# EAGLE design RepeterMySensorsXIAO (EAGLE 9.6.2)
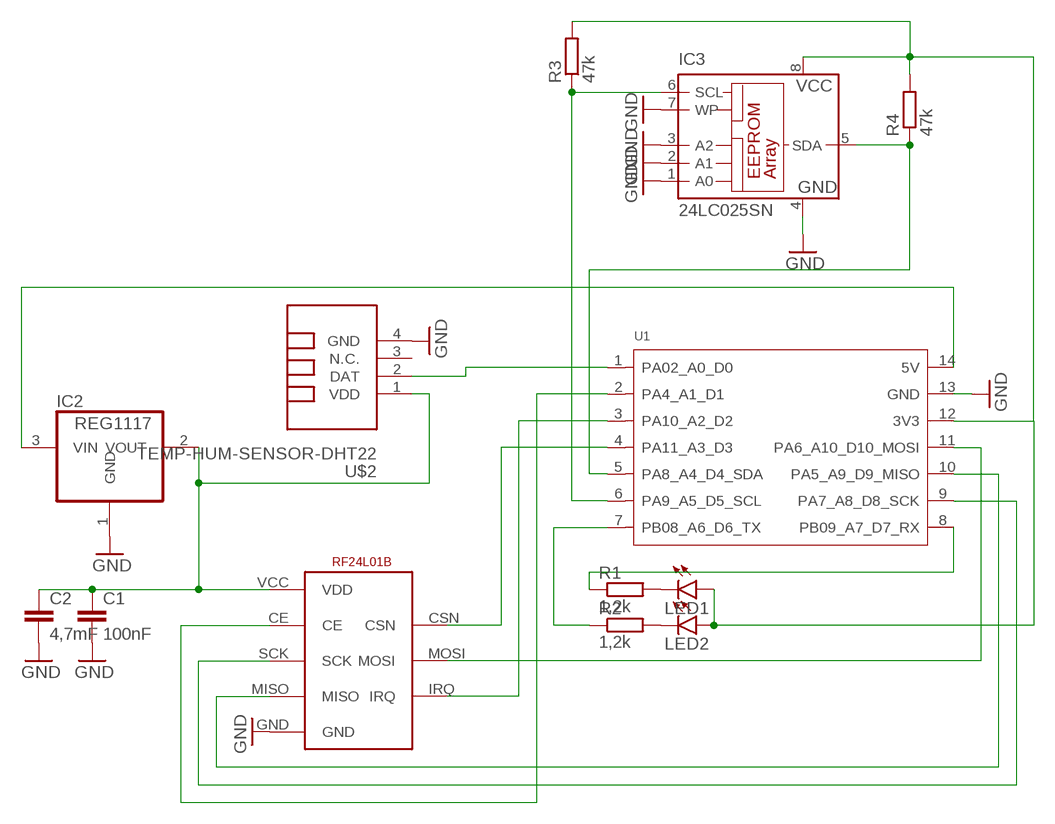
[diagram p0: schematic, sheet 1]

## Parts
C1  100nF  C-EUC1206  [C1206]
C2  4,7mF  C-EUC1210  [C1210]
IC2  REG1117  [SOT223]
IC3  24LC025SN  [SO-08]
LED1  LEDB152  [Q62902-B152]
LED2  LEDB152  [Q62902-B152]
R1  1,2k  R-EU_M1206  [M1206]
R2  1,2k  R-EU_M1206  [M1206]
R3  47k  R-EU_M1206  [M1206]
R4  47k  R-EU_M1206  [M1206]
U1  MOUDLE-SEEEDUINO-XIAO  [MOUDLE14P-2.54-21X17.8MM]
U$2  TEMP-HUM-SENSOR-DHT22  [TEMP-HUM-SENSOR-DHT22]
U$3  NRF24L01EBYTE  [24L01EBYTE]

## Nets
GND: C1.2 C2.2 IC2.1(GND) IC3.1(A0) IC3.2(A1) IC3.3(A2) IC3.4(GND) IC3.7(WP) U1.13(GND) U$2.4(GND) U$3.GND
N$1: C1.1 C2.1 IC2.2(VOUT) U$2.1(VDD) U$3.VCC(VDD)
N$2: U1.11(PA6_A10_D10_MOSI) U$3.MOSI
N$3: IC3.8(VCC) LED1.A LED2.A R3.2 R4.2 U1.12(3V3)
N$4: IC2.3(VIN) U1.14(5V)
N$5: LED1.K(C) R1.2
N$6: U1.3(PA10_A2_D2) U$3.IRQ
N$7: U1.4(PA11_A3_D3) U$3.CSN
N$8: U1.1(PA02_A0_D0) U$2.2(DAT)
N$9: U1.10(PA5_A9_D9_MISO) U$3.MISO
N$10: U1.9(PA7_A8_D8_SCK) U$3.SCK
N$11: LED2.K(C) R2.2
N$12: U1.2(PA4_A1_D1) U$3.CE
N$13: R2.1 U1.7(PB08_A6_D6_TX)
N$14: IC3.5(SDA) R4.1 U1.5(PA8_A4_D4_SDA)
N$15: IC3.6(SCL) R3.1 U1.6(PA9_A5_D5_SCL)
N$16: R1.1 U1.8(PB09_A7_D7_RX)
Unconnected: U$2.3(N.C.)

## Library data of the parts
C1 C2 = rcl:C-EU: CAPACITOR, European symbol; SPICEPREFIX: C
IC2 = burr-brown:REG1117: 800mA and 1A Low Dropout (LDO) Positive Regulator 1.8V, 2.5V, 2.85V, 3.3V, 5V, and Adj; MPN: REG1117; OC_FARNELL: 1097566; OC_NEWARK: 14P6981
IC3 = microchip:24*: Serial EEPROM I2C; MF: MICROCHIP; MPN: 24LC025/SN; OC_FARNELL: unknown; OC_NEWARK: 92C7103
LED1 LED2 = led:LED: LED OSRAM: - CHIPLED LG R971, LG N971, LY N971, LG Q971, LY Q971, LO R971, LY R971 LH N974, LH R974 LS Q976, LO Q976, LY Q976 LO Q996 - Hyper CHIPLED LW Q18S LB Q993, LB Q99A, LB R99A - SideLED LS A670, LO A670, LY A670, LG A670, LP A670 LB A673, LV A673, LT A673, LW A673 LH A674 LY A675 LS A676, LA A676, LO A676, LY A676, LW A676 LS A679, LY A679, LG A679 - Hyper Micro SIDELED® LS Y876, LA Y876, LO Y876, LY Y876 LT Y87S - SmartLED LW L88C, LW L88S LB L89C, LB L89S, LG L890 LS L89K, LO L89K, LY L89K LS L896, LA L896, LO L896, LY L896 - TOPLED LS T670, LO T670, LY T670, LG T670, LP T670 LSG T670, LSP T670, LSY T670, LOP T670, LYG T670 LG T671, LOG T671, LSG T671 LB T673, LV T673, LT T673, LW T673 LH T674 LS T676, LA T676, LO T676, LY T676, LB T676, LH T676, LSB T676, LW T676 LB T67C, LV T67C, LT T67C, LS T67K, LO T67K, LY T67K, LW E67C LS E67B, LA E67B, LO E67B, LY E67B, LB E67C, LV E67C, LT E67C LW T67C LS T679, LY T679, LG T679 LS T770, LO T770, LY T770, LG T770, LP T770 LB T773, LV T773, LT T773, LW T773 LH T774 LS E675, LA E675, LY E675, LS T675 LS T776, LA T776, LO T776, LY T776, LB T776 LHGB T686 LT T68C, LB T68C - Hyper Mini TOPLED® LB M676 - Mini TOPLED Santana® LG M470 LS M47K, LO M47K, LY M47K Source: http://www.osram.convergy.de LUXEON: - LUMILED® LXK2-PW12-R00, LXK2-PW12-S00, LXK2-PW14-U00, LXK2-PW14-V00 LXK2-PM12-R00, LXK2-PM12-S00, LXK2-PM14-U00 LXK2-PE12-Q00, LXK2-PE12-R00, LXK2-PE12-S00, LXK2-PE14-T00, LXK2-PE14-U00 LXK2-PB12-K00, LXK2-PB12-L00, LXK2-PB12-M00, LXK2-PB14-N00, LXK2-PB14-P00, LXK2-PB14-Q00 LXK2-PR12-L00, LXK2-PR12-M00, LXK2-PR14-Q00, LXK2-PR14-R00 LXK2-PD12-Q00, LXK2-PD12-R00, LXK2-PD12-S00 LXK2-PH12-R00, LXK2-PH12-S00 LXK2-PL12-P00, LXK2-PL12-Q00, LXK2-PL12-R00 Source: www.luxeon.com KINGBRIGHT: KA-3528ASYC Source: www.kingbright.com
R1-R4 = rcl:R-EU_: RESISTOR, European symbol; SPICEPREFIX: R
U1 = Seeeduino XIAO:MOUDLE-SEEEDUINO-XIAO
U$2 = diy-modules:TEMP-HUM-SENSOR-DHT22: DHT22 - digital humidity & temperature sensor Also known as: AM2302 AM2302 datasheet available here: http://akizukidenshi.com/download/ds/aosong/AM2302.pdf Click here to find device on ebay.com <http://www.ebay.com/sch/dht22+digital+sensor>
U$3 = nrf24l01:NRF24L01EBYTE

## Board
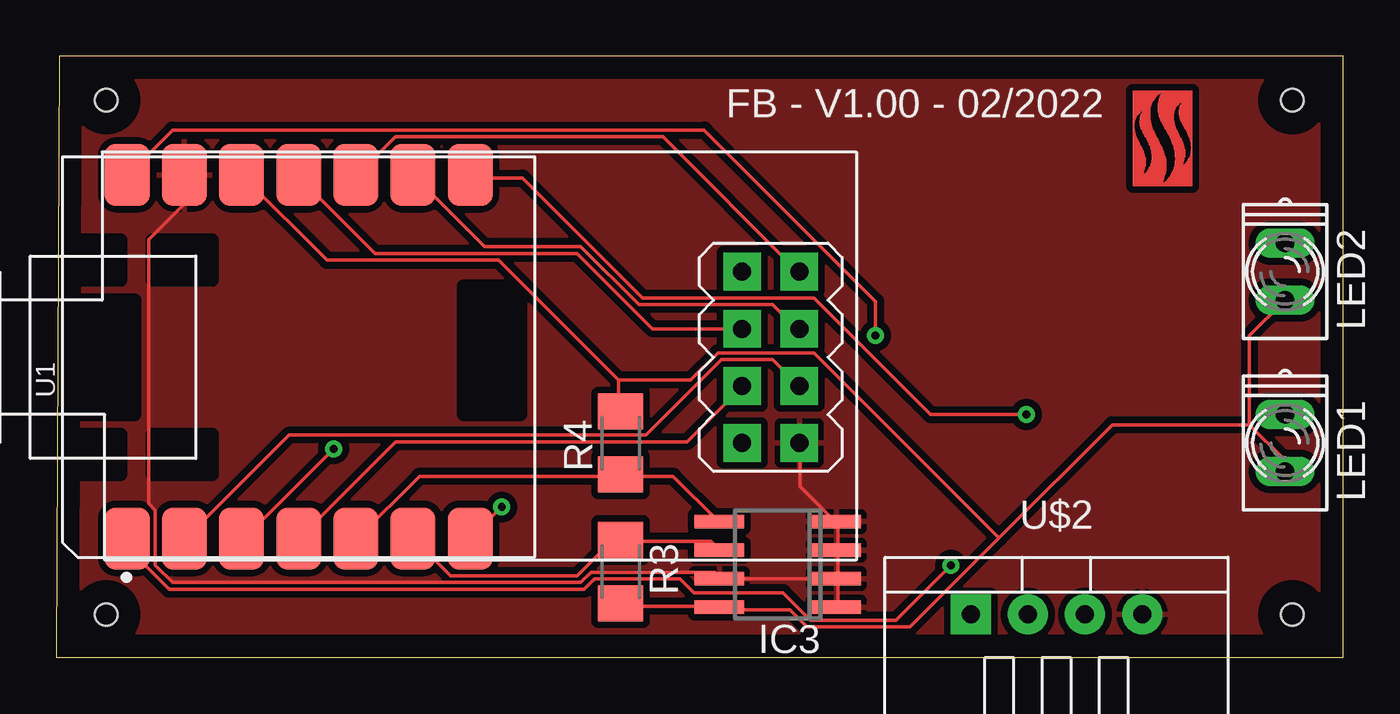
[diagram p1: board, top side]
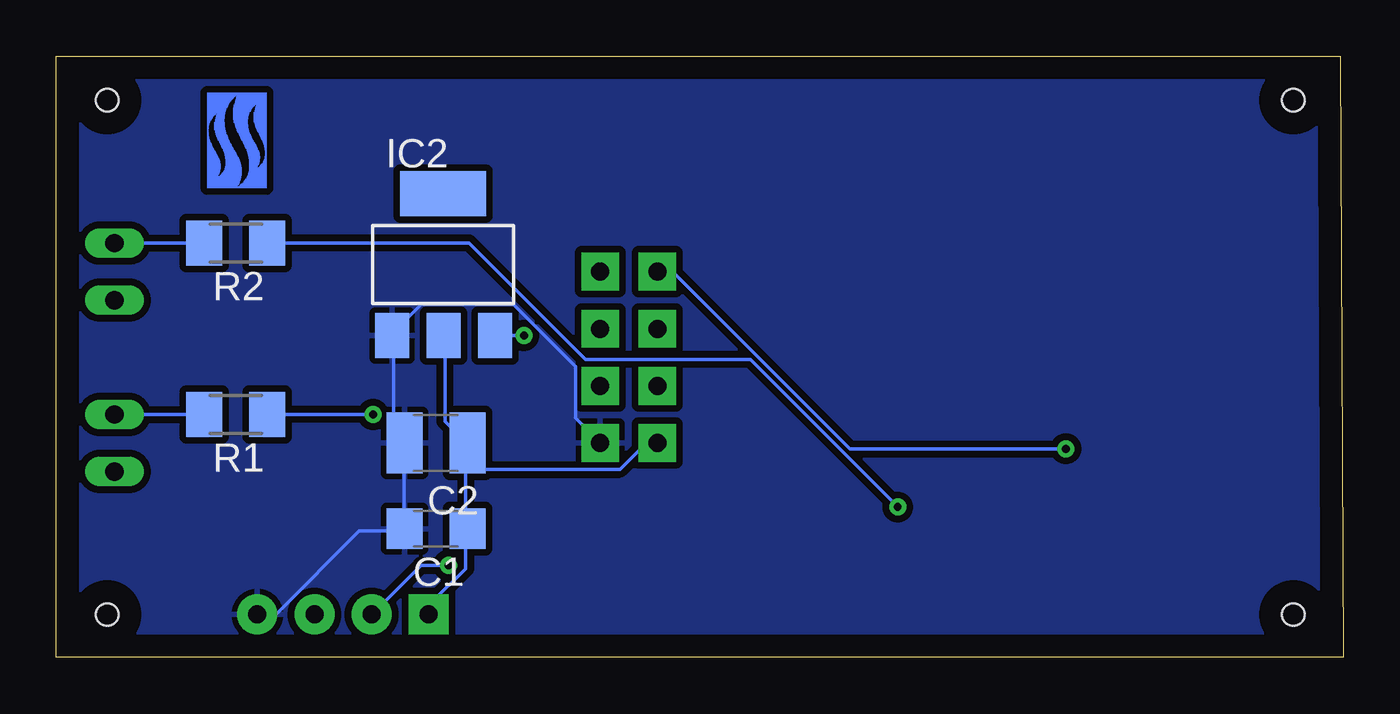
[diagram p2: board, bottom side, seen from below]

Size 57.19 x 26.72 mm. Coordinates in mm from the lower left corner, seen from the top.
Outline: 0,0 57.19,0 57.19,26.72 0.13,26.72 0,0
Copper layers (1*16): Top 0.035mm / dielectric 1.5mm / Bottom 0.035mm
Design rules "default": minimum track width 6mil, minimum drill 0.35mm, track to track 6mil, track to pad 6mil, pad to pad 6mil, via to via 6mil, smd to smd 6mil, copper to edge 40mil, drill to drill 6mil, minimum pad ring 10mil, minimum via ring 8mil, stop-mask expansion 4mil, vias tented up to drill 0mil, thermal gap 10mil
Holes 1 mm at 2.22,24.77 2.22,1.9 54.93,1.9 54.93,24.77

### Footprints (pad centres in the part's own frame; a part is rotated, then mirrored left to right if it is on the bottom)
C1206 = smd 1.6 x 1.8: 1 -1.4,0; 2 1.4,0
C1210 = smd 1.6 x 2.7: 1 -1.4,0; 2 1.4,0
SOT223 = smd 1.499 x 2.007: 1 -2.261,-3.15; 2 0.025,-3.15; 3 2.311,-3.15 | smd 3.81 x 2.007: 4 0,3.15
SO-08 = smd 0.6 x 2.2: 1 -1.905,-2.6; 2 -0.635,-2.6; 3 0.635,-2.6; 4 1.905,-2.6; 5 1.905,2.6; 6 0.635,2.6; 7 -0.635,2.6; 8 -1.905,2.6
Q62902-B152 = drill 0.813 long: A 1.27,0; K -1.27,0
M1206 = smd 1.6 x 2: 1 -1.4,0; 2 1.4,0
MOUDLE14P-2.54-21X17.8MM = smd 2.75 x 2: 1 0.835,18.12; 2 0.835,15.58; 3 0.835,13.04; 4 0.835,10.5; 5 0.835,7.96; 6 0.835,5.42; 7 0.835,2.88; 8 17,2.88; 9 17,5.42; 10 17,7.96; 11 17,10.5; 12 17,13.04; 13 17,15.58; 14 17,18.12
TEMP-HUM-SENSOR-DHT22 = drill 0.8 pad 1.778 square: 1 -3.81,0 | drill 0.8 pad 1.778: 2 -1.27,0; 3 1.27,0; 4 3.81,0
24L01EBYTE = drill 0.8 pad 1.676 square: CE -17.78,1.27; CSN -15.24,1.27; GND -17.78,3.81; IRQ -15.24,-3.81; MISO -17.78,-3.81; MOSI -15.24,-1.27; SCK -17.78,-1.27; VCC -15.24,3.81

### Placement (x,y rotation side)
C1  40.32,5.71 180 bottom
C2  40.32,9.53 180 bottom
IC2  40,17.46 0 bottom
IC3  32.07,4.13 90 top
LED1  54.61,9.53 270 top
LED2  54.61,17.14 270 top
R1  49.21,10.79 180 bottom
R2  49.21,18.41 180 bottom
R3  25.08,3.81 270 top
R4  25.08,9.53 90 top
U1  21.27,4.45 90 top
U$1  [FB]  50.48,20.95 0 bottom
U$2  44.45,1.9 0 top
U$3  15.24,13.34 180 top
U$4  [FB]  50.48,25.08 180 top

### Tracks (layer width: path | path; a pad name or v marks a point on that pad's centre or on a via)
GND
  Top 0.152: IC3.2 34.58,3.48 29.55,3.48 IC3.7 29.4,3.63 29.25,3.79 23.76,3.79 23.3,3.33 5.17,3.33 4.41,4.09 4.41,6.53 4.1,6.83 4.1,18.57 5.63,20.09 5.63,21.31 U1.13 | IC3.1 34.73,2.26 34.73,3.48 IC3.2 | IC3.2 34.73,3.63 34.73,4.7 IC3.3 34.73,4.85 34.73,5.92 IC3.4 34.58,6.07 33.06,7.59 33.06,9.42 U$3.GND
  Bottom 0.152: U$2.4 48.15,1.96 47.38,1.96 43.73,5.61 41.74,5.61 C1.2 41.74,5.77 41.74,9.42 C2.2 41.74,9.58 42.2,10.03 42.2,14.3 IC2.1 42.2,14.45 40.98,15.67 36.87,15.67 34.12,12.93 34.12,10.64 33.06,9.58 U$3.GND
  pour Top (isolate 0.305): -0.32,27.3 56.83,27.3 56.83,-0.64 -0.32,-0.64
  pour Bottom (isolate 0.305): -0.32,27.3 56.83,27.3 56.83,-0.64 -0.32,-0.64
N$1
  Bottom 0.152: 39,8.36 39,9.42 C2.1 | 39,8.36 39,5.77 C1.1 39,5.61 39,3.94 40.53,2.41 40.53,1.96 U$2.1 | IC2.2 39.92,14.3 39.92,10.49 39,9.58 C2.1 | 39,8.36 32.14,8.36 31.08,9.42 30.62,9.42 U$3.VCC | 39,8.36 C2.1
N$2
  Top 0.152: U$3.MOSI 26.5,14.61 23.15,17.96 14.16,17.96 10.81,21.31 U1.11
N$3
  Top 0.152: 24.98,12.32 24.98,10.95 R4.2 | 24.98,12.32 19.65,17.65 12.03,17.65 8.37,21.31 U1.12 | R3.2 25.13,2.26 29.4,2.26 IC3.8 29.55,2.11 32.6,2.11 33.36,1.35 37.93,1.35 41.9,5.31 | 53.02,10.34 54.55,8.81 54.55,8.36 LED1.A | 53.02,10.34 53.02,14.3 54.55,15.82 LED2.A | 41.9,5.31 46.93,10.34 53.02,10.34 | 24.98,12.32 28.18,12.32 29.4,13.54 33.67,13.54 41.9,5.31
N$4  (via drill 0.35)
  Top 0.152: v36.41,14.3 36.41,15.82 28.79,23.44 5.17,23.44 3.19,21.46 U1.14
  Bottom 0.152: v36.41,14.3 37.63,14.3 IC2.3
N$5
  Bottom 0.152: LED1.K R1.2
N$6  (via drill 0.35)
  Top 0.152: v12.33,9.27 8.37,5.31 U1.3
  Bottom 0.152: v12.33,9.27 21.93,9.27 29.71,17.04 30.47,17.04 U$3.IRQ
N$7
  Top 0.152: U1.4 10.81,5.31 15.07,9.58 28.03,9.58 30.47,12.01 U$3.CSN
N$8  (via drill 0.35)
  Top 0.152: v39.76,4.09 37.33,1.65 33.52,1.65 32.3,2.87 28.33,2.87 27.72,3.48 23.91,3.48 23.46,3.02 5.02,3.02 3.19,4.85 3.19,5.16 U1.1
  Bottom 0.152: v39.76,4.09 40.98,4.09 43.12,1.96 U$2.2
N$9
  Top 0.152: U1.10 13.4,21.46 15.07,23.14 26.96,23.14 32.91,17.2 U$3.MISO
N$10
  Top 0.152: U1.9 15.99,21.31 19.04,18.26 23.3,18.26 25.9,15.67 31.84,15.67 32.91,14.61 U$3.SCK
N$11
  Bottom 0.152: LED2.K R2.2
N$12
  Top 0.152: U1.2 5.78,5.31 10.35,9.88 26.2,9.88 29.55,13.23 31.84,13.23 32.91,12.17 U$3.CE
N$13  (via drill 0.35)
  Top 0.152: v19.8,6.68 18.43,5.31 U1.7
  Bottom 0.152: R2.1 38.85,18.41 33.67,13.23 26.35,13.23 v19.8,6.68
N$14
  Top 0.152: IC3.5 29.4,6.07 27.42,8.05 25.13,8.05 R4.1 24.98,8.05 16.14,8.05 13.4,5.31 U1.5
N$15
  Top 0.152: IC3.6 29.4,4.85 29.1,5.16 25.13,5.16 R3.1 24.98,5.16 24.68,5.16 23.15,3.63 17.51,3.63 15.99,5.16 U1.6
N$16  (via drill 0.35)
  Top 0.152: v43.12,10.79 38.85,10.79 33.67,15.98 26.05,15.98 20.71,21.31 18.43,21.31 U1.8
  Bottom 0.152: v43.12,10.79 R1.1

### Text on the board
tNames: FB - V1.00 - 02/2022